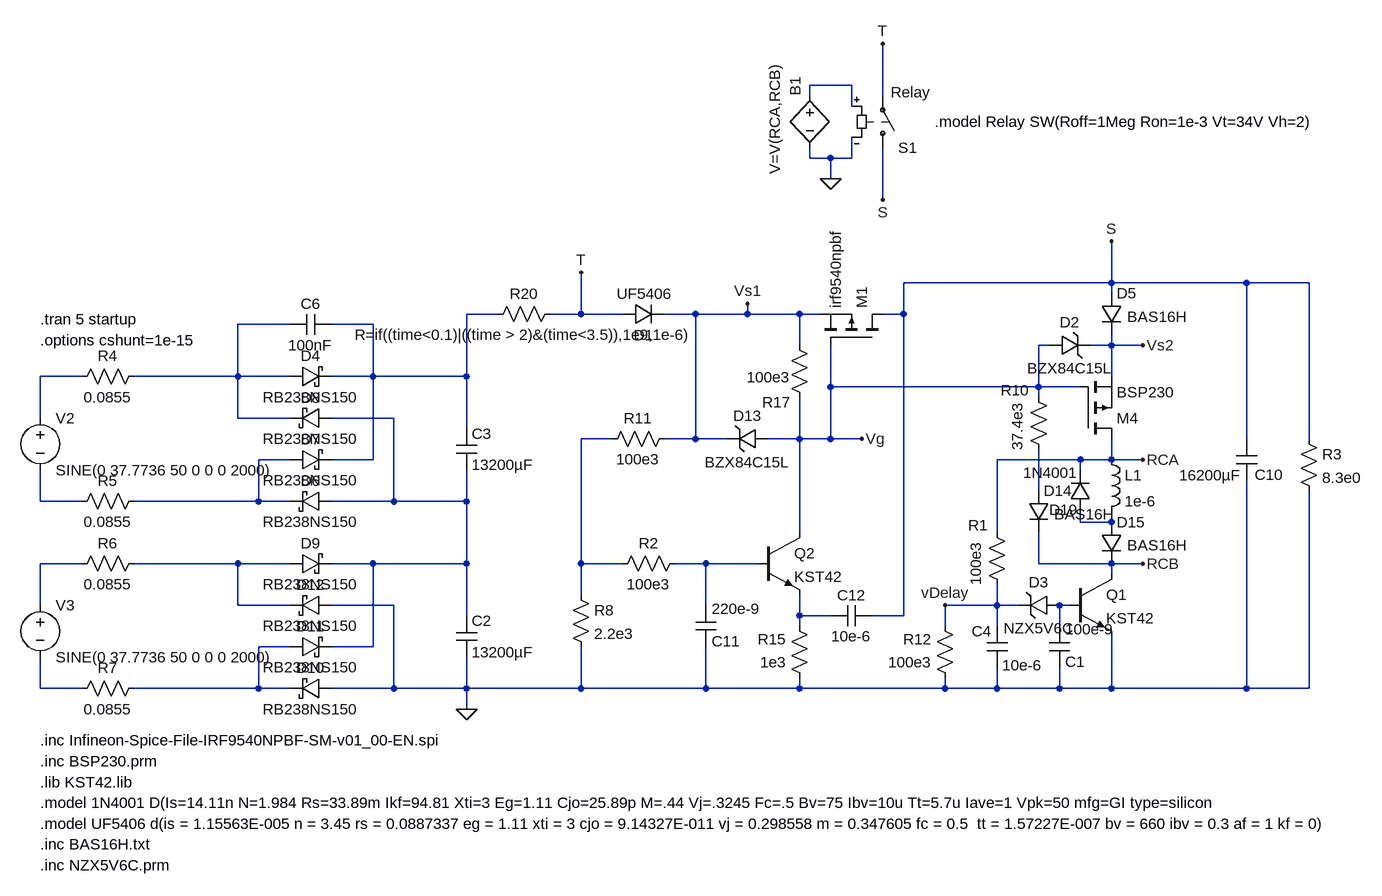
[diagram p0: schematic CapInrush3.asc]
CapInrush3.asc, the LTspice schematic file:
Version 4
SHEET 1 2944 968
WIRE -928 -544 -992 -544
WIRE -992 -528 -992 -544
WIRE -880 -528 -880 -608
WIRE -928 -512 -928 -544
WIRE -992 -432 -992 -448
WIRE -960 -432 -992 -432
WIRE -928 -432 -928 -464
WIRE -928 -432 -960 -432
WIRE -960 -400 -960 -432
WIRE -880 -368 -880 -448
WIRE -528 -240 -528 -304
WIRE -528 -240 -848 -240
WIRE -320 -240 -528 -240
WIRE -224 -240 -320 -240
WIRE -528 -224 -528 -240
WIRE -1472 -192 -1520 -192
WIRE -1344 -192 -1344 -256
WIRE -1344 -192 -1392 -192
WIRE -1280 -192 -1344 -192
WIRE -1168 -192 -1216 -192
WIRE -1088 -192 -1088 -208
WIRE -1088 -192 -1168 -192
WIRE -1008 -192 -1088 -192
WIRE -976 -192 -1008 -192
WIRE -848 -192 -848 -240
WIRE -848 -192 -880 -192
WIRE -1792 -176 -1872 -176
WIRE -1664 -176 -1728 -176
WIRE -1008 -144 -1008 -192
WIRE -624 -144 -640 -144
WIRE -528 -144 -528 -160
WIRE -528 -144 -560 -144
WIRE -480 -144 -528 -144
WIRE -2112 -96 -2176 -96
WIRE -1872 -96 -1872 -176
WIRE -1872 -96 -2032 -96
WIRE -1792 -96 -1872 -96
WIRE -1664 -96 -1664 -176
WIRE -1664 -96 -1728 -96
WIRE -1520 -96 -1520 -192
WIRE -1520 -96 -1664 -96
WIRE -528 -96 -528 -144
WIRE -960 -80 -960 -144
WIRE -640 -80 -640 -144
WIRE -640 -80 -960 -80
WIRE -576 -80 -640 -80
WIRE -640 -64 -640 -80
WIRE -2176 -32 -2176 -96
WIRE -1872 -32 -1872 -96
WIRE -1792 -32 -1872 -32
WIRE -1632 -32 -1728 -32
WIRE -1520 -16 -1520 -96
WIRE -1296 0 -1344 0
WIRE -1168 0 -1168 -192
WIRE -1168 0 -1216 0
WIRE -1120 0 -1168 0
WIRE -1008 0 -1008 -64
WIRE -1008 0 -1056 0
WIRE -960 0 -960 -80
WIRE -960 0 -1008 0
WIRE -912 0 -960 0
WIRE -320 0 -320 -240
WIRE -224 0 -224 -240
WIRE -1792 32 -1840 32
WIRE -1664 32 -1664 -96
WIRE -1664 32 -1728 32
WIRE -576 32 -704 32
WIRE -528 32 -528 0
WIRE -528 32 -576 32
WIRE -480 32 -528 32
WIRE -576 48 -576 32
WIRE -640 80 -640 16
WIRE -2176 96 -2176 48
WIRE -2112 96 -2176 96
WIRE -1840 96 -1840 32
WIRE -1840 96 -2032 96
WIRE -1792 96 -1840 96
WIRE -1632 96 -1632 -32
WIRE -1632 96 -1728 96
WIRE -1520 96 -1520 48
WIRE -1520 96 -1632 96
WIRE -576 128 -576 112
WIRE -528 128 -528 112
WIRE -528 128 -576 128
WIRE -1008 144 -1008 0
WIRE -704 144 -704 32
WIRE -2112 192 -2176 192
WIRE -1872 192 -2032 192
WIRE -1792 192 -1872 192
WIRE -1664 192 -1728 192
WIRE -1520 192 -1520 96
WIRE -1520 192 -1664 192
WIRE -1344 192 -1344 0
WIRE -1280 192 -1344 192
WIRE -1152 192 -1200 192
WIRE -1072 192 -1152 192
WIRE -640 192 -640 144
WIRE -528 192 -640 192
WIRE -480 192 -528 192
WIRE -528 208 -528 192
WIRE -1344 240 -1344 192
WIRE -2176 256 -2176 192
WIRE -1872 256 -1872 192
WIRE -1792 256 -1872 256
WIRE -1632 256 -1728 256
WIRE -1152 256 -1152 192
WIRE -704 256 -704 224
WIRE -704 256 -784 256
WIRE -672 256 -704 256
WIRE -592 256 -608 256
WIRE -1520 272 -1520 192
WIRE -1008 272 -1008 240
WIRE -960 272 -1008 272
WIRE -848 272 -848 -192
WIRE -848 272 -896 272
WIRE -1008 288 -1008 272
WIRE -784 288 -784 256
WIRE -704 288 -704 256
WIRE -608 288 -608 256
WIRE -1792 320 -1840 320
WIRE -1664 320 -1664 192
WIRE -1664 320 -1728 320
WIRE -2176 384 -2176 336
WIRE -2112 384 -2176 384
WIRE -1840 384 -1840 320
WIRE -1840 384 -2032 384
WIRE -1792 384 -1840 384
WIRE -1632 384 -1632 256
WIRE -1632 384 -1728 384
WIRE -1520 384 -1520 336
WIRE -1520 384 -1632 384
WIRE -1344 384 -1344 320
WIRE -1344 384 -1520 384
WIRE -1152 384 -1152 320
WIRE -1152 384 -1344 384
WIRE -1008 384 -1008 368
WIRE -1008 384 -1152 384
WIRE -784 384 -784 368
WIRE -784 384 -1008 384
WIRE -704 384 -704 352
WIRE -704 384 -784 384
WIRE -608 384 -608 352
WIRE -608 384 -704 384
WIRE -528 384 -528 304
WIRE -528 384 -608 384
WIRE -320 384 -320 64
WIRE -320 384 -528 384
WIRE -224 384 -224 80
WIRE -224 384 -320 384
WIRE -1520 416 -1520 384
FLAG -1520 416 0
FLAG -880 -608 T
FLAG -880 -368 S
FLAG -1344 -256 T
FLAG -528 -304 S
FLAG -480 32 RCA
FLAG -480 192 RCB
FLAG -960 -400 0
FLAG -912 0 Vg
FLAG -1088 -208 Vs1
FLAG -480 -144 Vs2
FLAG -784 256 vDelay
SYMBOL voltage -2176 -48 R0
WINDOW 123 0 0 Left 0
WINDOW 39 0 0 Left 0
SYMATTR InstName V2
SYMATTR Value SINE(0 37.7736 50 0 0 0 2000)
SYMBOL schottky -1792 -80 R270
WINDOW 0 32 32 VTop 2
WINDOW 3 0 32 VBottom 2
SYMATTR InstName D4
SYMATTR Value RB238NS150
SYMATTR Description Diode
SYMATTR Type diode
SYMBOL schottky -1728 80 R90
WINDOW 0 0 32 VBottom 2
WINDOW 3 32 32 VTop 2
SYMATTR InstName D6
SYMATTR Value RB238NS150
SYMATTR Description Diode
SYMATTR Type diode
SYMBOL schottky -1792 48 R270
WINDOW 0 32 32 VTop 2
WINDOW 3 0 32 VBottom 2
SYMATTR InstName D7
SYMATTR Value RB238NS150
SYMATTR Description Diode
SYMATTR Type diode
SYMBOL schottky -1728 -48 R90
WINDOW 0 0 32 VBottom 2
WINDOW 3 32 32 VTop 2
SYMATTR InstName D8
SYMATTR Value RB238NS150
SYMATTR Description Diode
SYMATTR Type diode
SYMBOL res -2016 -112 R90
WINDOW 0 0 56 VBottom 2
WINDOW 3 32 56 VTop 2
SYMATTR InstName R4
SYMATTR Value 0.0855
SYMBOL schottky -1792 208 R270
WINDOW 0 32 32 VTop 2
WINDOW 3 0 32 VBottom 2
SYMATTR InstName D9
SYMATTR Value RB238NS150
SYMATTR Description Diode
SYMATTR Type diode
SYMBOL schottky -1728 368 R90
WINDOW 0 0 32 VBottom 2
WINDOW 3 32 32 VTop 2
SYMATTR InstName D10
SYMATTR Value RB238NS150
SYMATTR Description Diode
SYMATTR Type diode
SYMBOL schottky -1792 336 R270
WINDOW 0 32 32 VTop 2
WINDOW 3 0 32 VBottom 2
SYMATTR InstName D11
SYMATTR Value RB238NS150
SYMATTR Description Diode
SYMATTR Type diode
SYMBOL schottky -1728 240 R90
WINDOW 0 0 32 VBottom 2
WINDOW 3 32 32 VTop 2
SYMATTR InstName D12
SYMATTR Value RB238NS150
SYMATTR Description Diode
SYMATTR Type diode
SYMBOL res -2016 80 R90
WINDOW 0 0 56 VBottom 2
WINDOW 3 32 56 VTop 2
SYMATTR InstName R5
SYMATTR Value 0.0855
SYMBOL voltage -2176 240 R0
WINDOW 123 0 0 Left 0
WINDOW 39 0 0 Left 0
SYMATTR InstName V3
SYMATTR Value SINE(0 37.7736 50 0 0 0 2000)
SYMBOL res -2016 176 R90
WINDOW 0 0 56 VBottom 2
WINDOW 3 32 56 VTop 2
SYMATTR InstName R6
SYMATTR Value 0.0855
SYMBOL res -2016 368 R90
WINDOW 0 0 56 VBottom 2
WINDOW 3 32 56 VTop 2
SYMATTR InstName R7
SYMATTR Value 0.0855
SYMBOL cap -1728 -192 R90
WINDOW 0 0 32 VBottom 2
WINDOW 3 32 32 VTop 2
SYMATTR InstName C6
SYMATTR Value 100nF
SYMATTR SpiceLine V=60
SYMBOL cap -1536 272 R0
SYMATTR InstName C2
SYMATTR Value 13200µF
SYMATTR SpiceLine V=50 Rser=0.03
SYMBOL cap -1536 -16 R0
SYMATTR InstName C3
SYMATTR Value 13200µF
SYMATTR SpiceLine V=50 Rser=0.03
SYMBOL pmos -880 -144 M270
SYMATTR InstName M1
SYMATTR Value irf9540npbf
SYMATTR Prefix X
SYMBOL cap -336 0 R0
WINDOW 0 28 55 Left 2
WINDOW 3 -88 56 Left 2
SYMATTR InstName C10
SYMATTR Value 16200µF
SYMATTR SpiceLine V=80 Rser=0.016
SYMBOL res -240 -16 R0
SYMATTR InstName R3
SYMATTR Value 8.3e0
SYMBOL res -1360 224 R0
SYMATTR InstName R8
SYMATTR Value 2.2e3
SYMBOL pmos -576 0 M180
SYMATTR InstName M4
SYMATTR Value BSP230
SYMATTR Prefix X
SYMBOL zener -1056 -16 R90
WINDOW 0 -4 32 VBottom 2
WINDOW 3 36 32 VTop 2
SYMATTR InstName D13
SYMATTR Value BZX84C15L
SYMBOL res -1200 -16 R90
WINDOW 0 0 56 VBottom 2
WINDOW 3 32 56 VTop 2
SYMATTR InstName R11
SYMATTR Value 100e3
SYMBOL cap -1168 256 R0
WINDOW 0 25 55 Left 2
WINDOW 3 25 5 Left 2
SYMATTR InstName C11
SYMATTR Value 220e-9
SYMBOL npn -1072 144 R0
SYMATTR InstName Q2
SYMATTR Value KST42
SYMBOL res -992 384 R180
WINDOW 0 36 76 Left 2
WINDOW 3 36 40 Left 2
SYMATTR InstName R15
SYMATTR Value 1e3
SYMBOL res -992 -48 R180
WINDOW 0 29 8 Left 2
WINDOW 3 30 47 Left 2
SYMATTR InstName R17
SYMATTR Value 100e3
SYMBOL cap -896 256 R90
WINDOW 0 0 32 VBottom 2
WINDOW 3 32 32 VTop 2
SYMATTR InstName C12
SYMATTR Value 10e-6
SYMBOL diode -656 80 R0
WINDOW 3 40 36 Left 2
SYMATTR Value BAS16H
SYMATTR InstName D14
SYMBOL ind -544 16 R0
SYMATTR InstName L1
SYMATTR Value 1e-6
SYMATTR SpiceLine Rser=7.2e3
SYMBOL diode -592 112 M180
WINDOW 0 -32 3 Left 2
WINDOW 3 -72 60 Left 2
SYMATTR InstName D19
SYMATTR Value 1N4001
SYMBOL res -1376 -208 R90
WINDOW 0 0 56 VBottom 2
WINDOW 3 32 54 VTop 2
SYMATTR InstName R20
SYMATTR Value R=if((time<0.1)|((time > 2)&(time<3.5)),1e9,1e-6)
SYMBOL diode -1280 -176 R270
WINDOW 0 -32 32 VTop 2
WINDOW 3 63 34 VBottom 2
SYMATTR InstName D1
SYMATTR Value UF5406
SYMBOL sw -880 -432 M180
WINDOW 3 12 101 Left 2
SYMATTR Value Relay
SYMATTR InstName S1
SYMBOL bv -992 -544 R0
WINDOW 0 -22 -13 VRight 2
WINDOW 3 -54 -32 VRight 2
SYMATTR InstName B1
SYMATTR Value V=V(RCA,RCB)
SYMBOL res -1184 176 R90
WINDOW 0 0 56 VBottom 2
WINDOW 3 32 56 VTop 2
SYMATTR InstName R2
SYMATTR Value 100e3
SYMBOL zener -624 -128 R270
WINDOW 0 36 32 VTop 2
WINDOW 3 -4 32 VBottom 2
SYMATTR InstName D2
SYMATTR Value BZX84C15L
SYMBOL cap -688 352 R180
WINDOW 0 24 56 Left 2
WINDOW 3 -54 4 Left 2
SYMATTR InstName C4
SYMATTR Value 10e-6
SYMBOL res -688 240 R180
WINDOW 0 30 107 Left 2
WINDOW 3 49 14 VRight 2
SYMATTR InstName R1
SYMATTR Value 100e3
SYMBOL zener -608 240 R90
WINDOW 0 -4 32 VBottom 2
WINDOW 3 36 32 VTop 2
SYMATTR InstName D3
SYMATTR Value NZX5V6C
SYMATTR Prefix X
SYMBOL diode -544 -224 R0
WINDOW 3 40 36 Left 2
SYMATTR Value BAS16H
SYMATTR InstName D5
SYMBOL res -624 32 R180
WINDOW 0 30 107 Left 2
WINDOW 3 49 14 VRight 2
SYMATTR InstName R10
SYMATTR Value 37.4e3
SYMBOL res -768 384 R180
WINDOW 0 36 76 Left 2
WINDOW 3 36 40 Left 2
SYMATTR InstName R12
SYMATTR Value 100e3
SYMBOL npn -592 208 R0
SYMATTR InstName Q1
SYMATTR Value KST42
SYMBOL diode -544 128 R0
WINDOW 3 40 36 Left 2
SYMATTR Value BAS16H
SYMATTR InstName D15
SYMBOL cap -624 288 R0
WINDOW 0 25 55 Left 2
WINDOW 3 25 5 Left 2
SYMATTR InstName C1
SYMATTR Value 100e-9
TEXT -2176 -184 Left 2 !.tran 5 startup
TEXT -2176 592 Left 2 !.model UF5406 d(is = 1.15563E-005 n = 3.45 rs = 0.0887337 eg = 1.11 xti = 3 cjo = 9.14327E-011 vj = 0.298558 m = 0.347605 fc = 0.5  tt = 1.57227E-007 bv = 660 ibv = 0.3 af = 1 kf = 0)
TEXT -2176 464 Left 2 !.inc Infineon-Spice-File-IRF9540NPBF-SM-v01_00-EN.spi
TEXT -2176 -152 Left 2 !.options cshunt=1e-15
TEXT -2176 624 Left 2 !.inc BAS16H.txt
TEXT -2176 496 Left 2 !.inc BSP230.prm
TEXT -2176 560 Left 2 !.model 1N4001 D(Is=14.11n N=1.984 Rs=33.89m Ikf=94.81 Xti=3 Eg=1.11 Cjo=25.89p M=.44 Vj=.3245 Fc=.5 Bv=75 Ibv=10u Tt=5.7u Iave=1 Vpk=50 mfg=GI type=silicon
TEXT -800 -488 Left 2 !.model Relay SW(Roff=1Meg Ron=1e-3 Vt=34V Vh=2)
TEXT -2176 528 Left 2 !.lib KST42.lib
TEXT -2176 656 Left 2 !.inc NZX5V6C.prm

The netlist it stands for:
* CapInrush3.asc
V2 N004 N009 SINE(0 37.7736 50 0 0 0 2000)
D4 N003 N002 RB238NS150
D6 N005 N007 RB238NS150
D7 N007 N002 RB238NS150
D8 N005 N003 RB238NS150
R4 N003 N004 0.0855
D9 N012 N005 RB238NS150
D10 0 N016 RB238NS150
D11 N016 N005 RB238NS150
D12 0 N012 RB238NS150
R5 N007 N009 0.0855
V3 N011 N017 SINE(0 37.7736 50 0 0 0 2000)
R6 N012 N011 0.0855
R7 N016 N017 0.0855
C6 N002 N003 100nF V=60
C2 N005 0 13200µF V=50 Rser=0.03
C3 N002 N005 13200µF V=50 Rser=0.03
XM1 S Vg Vs1 irf9540npbf  ; pins D G S
C10 S 0 16200µF V=80 Rser=0.016
R3 S 0 8.3e0
R8 N006 0 2.2e3
XM4 RCA Vg Vs2 BSP230  ; pins D G S
D13 Vg Vs1 BZX84C15L
R11 Vs1 N006 100e3
C11 N013 0 220e-9
Q2 Vg N013 N015 0 KST42
R15 0 N015 1e3
R17 Vg Vs1 100e3
C12 S N015 10e-6
D14 N008 RCB BAS16H
L1 RCA N010 1e-6 Rser=7.2e3
D19 N010 RCA 1N4001
R20 T N002 R=if((time<0.1)|((time > 2)&(time<3.5)),1e9,1e-6)
D1 T Vs1 UF5406
S1 S T N001 0 Relay
B1 N001 0 V=V(RCA,RCB)
R2 N013 N006 100e3
D2 Vg Vs2 BZX84C15L
C4 0 vDelay 10e-6
R1 vDelay RCA 100e3
XD3 N014 vDelay NZX5V6C  ; pins + -
D5 S Vs2 BAS16H
R10 N008 Vg 37.4e3
R12 0 vDelay 100e3
Q1 RCB N014 0 0 KST42
D15 N010 RCB BAS16H
C1 N014 0 100e-9
.model D D
.lib standard.dio
.model NPN NPN
.model PNP PNP
.lib standard.bjt
.tran 5 startup
.model UF5406 d(is = 1.15563E-005 n = 3.45 rs = 0.0887337 eg = 1.11 xti = 3 cjo = 9.14327E-011 vj = 0.298558 m = 0.347605 fc = 0.5  tt = 1.57227E-007 bv = 660 ibv = 0.3 af = 1 kf = 0)
.inc Infineon-Spice-File-IRF9540NPBF-SM-v01_00-EN.spi
.options cshunt=1e-15
.inc BAS16H.txt
.inc BSP230.prm
.model 1N4001 D(Is=14.11n N=1.984 Rs=33.89m Ikf=94.81 Xti=3 Eg=1.11 Cjo=25.89p M=.44 Vj=.3245 Fc=.5 Bv=75 Ibv=10u Tt=5.7u Iave=1 Vpk=50 mfg=GI type=silicon
.model Relay SW(Roff=1Meg Ron=1e-3 Vt=34V Vh=2)
.lib KST42.lib
.inc NZX5V6C.prm
.backanno
.end